# Altium schematic sheet MCU.SchDoc
size Legal; Author: FF7 HD Remastered; SheetNumber: 3; SheetTotal: 7
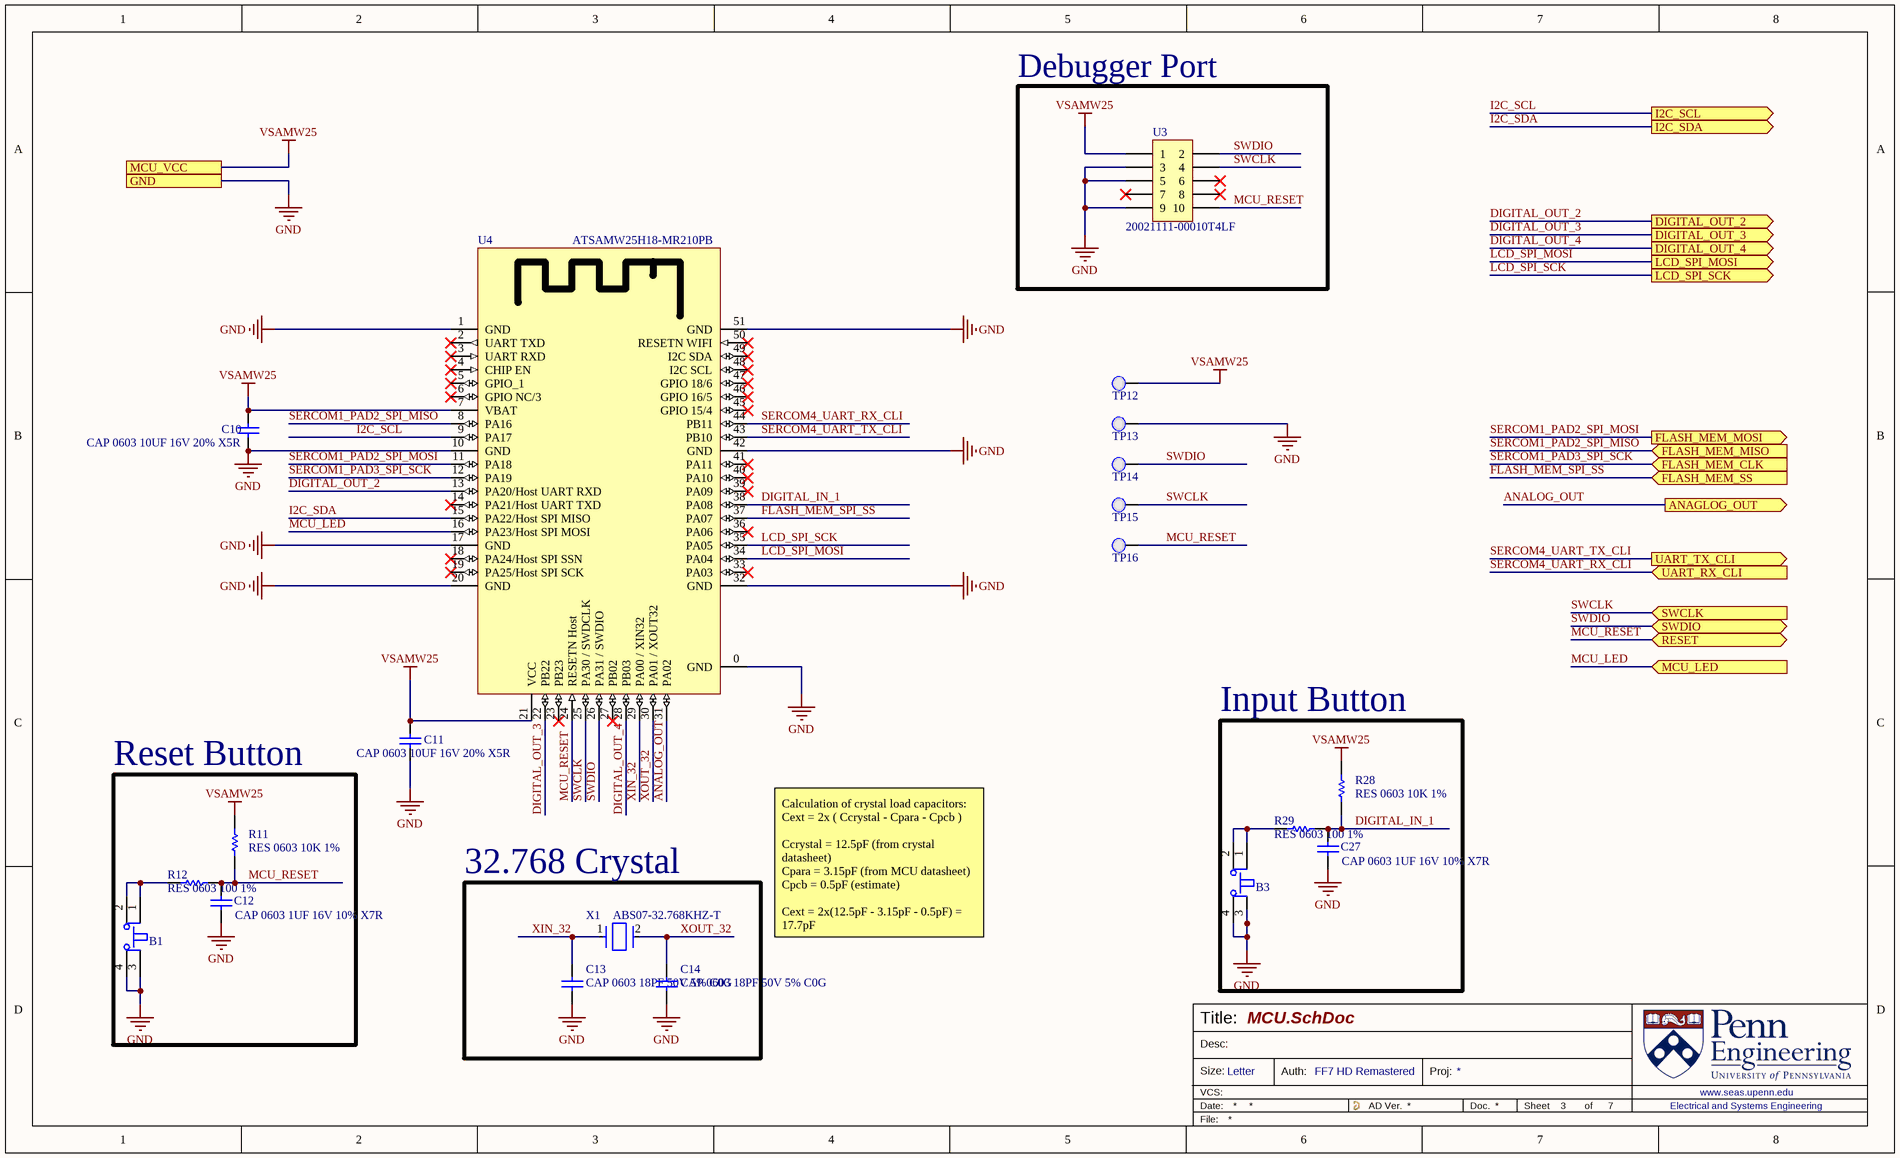
[diagram p0: MCU.SchDoc]

## Parts
B1  PTS810SJK250SMTRLFS  [PTS810SJK250SMTRLFS-Footprint-1]  (value not drawn)
B3  PTS810SJK250SMTRLFS  [PTS810SJK250SMTRLFS-Footprint-1]  (value not drawn)
C10  CAP 0603 10UF 16V 20% X5R  [0603_CAP]
C11  CAP 0603 10UF 16V 20% X5R  [0603_CAP]
C12  CAP 0603 1UF 16V 10% X7R  [0603_CAP]
C13  CAP 0603 18PF 50V 5% C0G  [0603_CAP]
C14  CAP 0603 18PF 50V 5% C0G  [0603_CAP]
C27  CAP 0603 1UF 16V 10% X7R  [0603_CAP]
R11  RES 0603 10K 1%  [0603_RES]
R12  RES 0603 100 1%  [0603_RES]
R28  RES 0603 10K 1%  [0603_RES]
R29  RES 0603 100 1%  [0603_RES]
TP12  Test Point 0.1"  [Test Point 0.1"-Footprint-1]  (value not drawn)  (no BOM)
TP13  Test Point 0.1"  [Test Point 0.1"-Footprint-1]  (value not drawn)  (no BOM)
TP14  Test Point 0.1"  [Test Point 0.1"-Footprint-1]  (value not drawn)  (no BOM)
TP15  Test Point 0.1"  [Test Point 0.1"-Footprint-1]  (value not drawn)  (no BOM)
TP16  Test Point 0.1"  [Test Point 0.1"-Footprint-1]  (value not drawn)  (no BOM)
U3  20021111-00010T4LF  [20021111-00010T4LF-Footprint-1]
U4  ATSAMW25H18-MR210PB  [SAMW25H18-MR510PB-Footprint-1]
X1  ABS07-32.768KHZ-T  [FP-ABS07-MFG]

## Blocks framed on the sheet
Debugger Port: U3
Input Button: B3 C27 R28 R29
Reset Button: B1 C12 R11 R12
32.768 Crystal: C13 C14 X1

## Ports
ANAGLOG_OUT (out), DIGITAL_OUT_2 (out), DIGITAL_OUT_3 (out), DIGITAL_OUT_4 (out), FLASH_MEM_CLK (in), FLASH_MEM_MISO (in), FLASH_MEM_MOSI (out), FLASH_MEM_SS (in), GND, I2C_SCL (out), I2C_SDA (out), LCD_SPI_MOSI (out), LCD_SPI_SCK (out), MCU_LED (in), MCU_VCC, RESET (bidir), SWCLK (in), SWDIO (bidir), UART_RX_CLI (in), UART_TX_CLI (out)

## Nets
GND: B1.3 B1.4 B3.3 B3.4 C10.1 C11.1 C12.1 C13.1 C14.1 C27.1 TP13.1(PAD) U3.3 U3.5 U3.9 U4.0(GND) U4.1(GND) U4.10(GND) U4.17(GND) U4.20(GND) U4.32(GND) U4.42(GND) U4.51(GND) ; port GND
VSAMW25: C10.2 C11.2 R11.2 R28.2 TP12.1(PAD) U3.1 U4.7(VBAT) U4.21(VCC) ; port MCU_VCC
ANALOG_OUT: U4.31(PA02) ; port ANAGLOG_OUT
DIGITAL_IN_1: C27.2 R28.1 R29.2 U4.38(PA08)
DIGITAL_OUT_2: U4.13(PA20/Host_UART_RXD) ; port DIGITAL_OUT_2
DIGITAL_OUT_3: U4.22(PB22) ; port DIGITAL_OUT_3
DIGITAL_OUT_4: U4.28(PB03) ; port DIGITAL_OUT_4
FLASH_MEM_SPI_SS: U4.37(PA07) ; port FLASH_MEM_SS
I2C_SCL: U4.9(PA17) ; port I2C_SCL
I2C_SDA: U4.15(PA22/Host_SPI_MISO) ; port I2C_SDA
LCD_SPI_MOSI: U4.34(PA04) ; port LCD_SPI_MOSI
LCD_SPI_SCK: U4.35(PA05) ; port LCD_SPI_SCK
MCU_LED: U4.16(PA23/Host_SPI_MOSI) ; port MCU_LED
MCU_RESET: C12.2 R11.1 R12.2 TP16.1(PAD) U3.10 U4.24(RESETN_Host) ; port RESET
SERCOM1_PAD2_SPI_MISO: U4.8(PA16) ; port FLASH_MEM_MISO
SERCOM1_PAD2_SPI_MOSI: U4.11(PA18) ; port FLASH_MEM_MOSI
SERCOM1_PAD3_SPI_SCK: U4.12(PA19) ; port FLASH_MEM_CLK
SERCOM4_UART_RX_CLI: U4.44(PB11) ; port UART_RX_CLI
SERCOM4_UART_TX_CLI: U4.43(PB10) ; port UART_TX_CLI
SWCLK: TP15.1(PAD) U3.4 U4.25(PA30_/_SWDCLK) ; port SWCLK
SWDIO: TP14.1(PAD) U3.2 U4.26(PA31_/_SWDIO) ; port SWDIO
XIN_32: C13.2 U4.29(PA00_/_XIN32) X1.1
XOUT_32: C14.2 U4.30(PA01_/_XOUT32) X1.2
NetB1_1: B1.1 B1.2 R12.1
NetB3_1: B3.1 B3.2 R29.1

Not connected (* = marked no-connect by the designer): U3 6* 7* 8*; U4 2(UART_TXD)* 3(UART_RXD)* 4(CHIP_EN)* 5(GPIO_1)* 6(GPIO_NC/3)* 14(PA21/Host_UART_TXD)* 18(PA24/Host_SPI_SSN)* 19(PA25/Host_SPI_SCK)* 23(PB23)* 27(PB02)* 33(PA03)* 36(PA06)* 39(PA09)* 40(PA10)* 41(PA11)* 45(GPIO_15/4)* 46(GPIO_16/5)* 47(GPIO_18/6)* 48(I2C_SCL)* 49(I2C_SDA)* 50(RESETN_WIFI)*

## Notes on the sheet
- Calculation of crystal load capacitors:
  Cext = 2x ( Ccrystal - Cpara - Cpcb )
  Ccrystal = 12.5pF (from crystal datasheet)
  Cpara = 3.15pF (from MCU datasheet)
  Cpcb = 0.5pF (estimate)
  Cext = 2x(12.5pF - 3.15pF - 0.5pF) = 17.7pF
- Title:
- Desc:
- Size:
- Letter
- Auth:
- Proj:
- Sheet
- of
- www.seas.upenn.edu
- Electrical and Systems Engineering

## Library data of the parts
B1 B3 = CMP-00084-2: Keypad Switch, 1 Switches, SPST, Momentary-tactile, 0.05A, 16VDC, 3.23N, Solder Terminal, Surface Mount-straight; Manufacturer Series: PTS810; Actuator Length: 0.028inch; Electrical Life: 50000Cycles; Contact Resistance: 0.5mR; Solderability: REFLOW; Actuator Travel: 0.1524mm; Actuator Color: White; Actuator Type: Pushbutton; Insulation Resistance: 100MR; Dielectric Withstand Volts: 250VACV; Switch Function: OFF-MOM; Reach SVHC Compliant: Yes; Terminal Finish: Silver; Switch Type: Keypad; Switch Action: MOMENTARY; RoHS Compliant: Yes; JESD-609 Code: e4; Max Operating Temperature: 85°C; Termination: Solder; Min Operating Temperature: -40°C; Mounting Technology: Surface Mount; Circuit: SPST; Type: Tactile
C10 C11 = CMP-011-000263-1: Capacitor Surface Mount 0603 Footprint 10UF 16V 20% Tolerance Ceramic X5R; Manufacturer: Various; Description in Visual: Cap SMT 0603 10UF 16V 20% Ceramic X5R; PCB Package: 0603; Type: Ceramic X5R; Mount: SMT; P/N: CAP 0603 10UF 16V 20% X5R; Manufacturer P/N: CAP 0603 10UF 16V 20% X5R
C12 C27 = CMP-011-000286-1: Capacitor Surface Mount 0603 Footprint 1UF 16V 10% Tolerance Ceramic X7R; Manufacturer: Various; PCB Package: 0603; Description in Visual: Cap SMT 0603 1UF 16V 10% Ceramic X7R; P/N: CAP 0603 1UF 16V 10% X7R; Manufacturer P/N: CAP 0603 1UF 16V 10% X7R; Tolerance: 10%; Type: Ceramic X7R; Value: 1UF; Mount: SMT; Voltage: 16V
C13 C14 = CMP-011-000283-1: Capacitor Surface Mount 0603 Footprint 18PF 50V 5% Tolerance Ceramic C0G; Manufacturer: Various; Description in Visual: Cap SMT 0603 18PF 50V 5%  Cer C0G; PCB Package: 0603; Voltage: 50V; Type: Ceramic C0G; Tolerance: 5%; Manufacturer P/N: CAP 0603 18PF 50V 5% C0G; Value: 18PF; P/N: CAP 0603 18PF 50V 5% C0G; Mount: SMT
R11 R28 = CMP-005-002156-2: Resistor Surface Mount, 10K Ohms, 0603 Footprint, 1% Tolerance 0.1W; Manufacturer: Various; PCB Package: 0603; Description in Visual: Res SMT 10K 0603  1%  0.1W; Manufacturer P/N: RES 0603 10K 1%; Tolerance: 1%; Mount: SMT; Value: 10k; JLCPCB Part #: C25804; Power Rating: 0.1W
R12 R29 = CMP-005-002125-1: Resistor Surface Mount, 100 Ohms, 0603 Footprint, 1% Tolerance 0.1W; Manufacturer: Various; Manufacturer P/N: RES 0603 100R 1%; Value: 100; Description in Visual: Res SMT 100 0603  1%  0.1W; PCB Package: 0603; Mount: SMT; Tolerance: 1%; Power Rating: 0.1W
TP12-TP16 = CMP-00086-1
U3 = CMP-00083-1: Board Connector, 10 Contact(s), 2 Row(s), Male, Straight, 0.05 inch Pitch, Solder Terminal, Locking, Black Insulator, Receptacle; Number Of PCB Rows: 2; PCB Contact Pattern: RECTANGULAR; Option: General Purpose; Body Depth: 0.098inch; Insulation Resistance: 100MR; Dielectric Withstanding Voltage (AC): 700V; Withdrawl Force-Min: 0.1946N; Body Length: 0.25inch; IEC Conformance: No; Body Breadth: 0.135inch; Rated Current (Signal): 1A; Plating Thickness: 10uin; Reliability: COMMERCIAL; Number Of Connectors: 1; PCB Contact Row Spacing: 1.27mm; Insertion Force-Max: 2.1406N; Contact Style: SQ PIN-SKT; Durability: 100Cycles; Contact Resistance: 30mR; Number of Contacts: 10; Reference Standard: UL; Insulation Material: Thermoplastic; Connector Type: BOARD CONNECTOR; Termination: Solder; Contact Finish - Mating: GOLD (10); Mounting Technology: Board; RoHS Compliant: Yes; Terminal Length: 0.091inch; Body/Shell Style: RECEPTACLE; Number of Rows Loaded: 2; Contact Gender: Male; Terminal Pitch: 1.27mm; Max Operating Temperature: 125°C; Mounting Option 1: LOCKING; JESD-609 Code: e3; DIN Conformance: No; Reach SVHC Compliant: Yes; Contact Finish - Termination: Matte Tin (Sn); Mounting Style: STRAIGHT; Min Operating Temperature: -40°C; MIL Conformance: No; Contact Material: Copper Alloy; Filter Feature: No; Mating Contact Pitch: 0.05inch; Insulation Color: Black; Flammability Rating: UL94 V-0; Mating Contact Row Spacing: 0.05inch; Mixed Contacts: No; Contact Pattern: RECTANGULAR
U4 = CMP-00082-2: 2.7 - 4.2 V 65 Mbps 17 dbm 256 kB Flash 32 kB SRAM 802.11 b/g/n Smart Module
X1 = CMP-0447-00001-4: Crystal 32.768kHz ±20ppm (Tol) 12.5pF FUND 70kΩ 2-Pin CSMD T/R; ESR (Equivalent Series Resistance): 70kR; Frequency: 32.768kHz; Radiation Hardening: No; Length: 3.2mm; Max Operating Temperature: 85°C; Number of Pins: 2; Series: ABS07; Min Operating Temperature: -40°C; Frequency Tolerance: 20ppm; Packaging: Tape and Reel; Height: 0.9mm; Width: 1.5mm; Depth: 1.5mm; Load Capacitance: 12.5pF; RoHS Compliant: Yes; Tolerance: 20ppm; Termination: SMD/SMT; Lead Free: Lead Free; Series Resistance: 70kR; REACH SVHC: No SVHC; Case/Package: CSMD; Operating Frequency: 32.768 kHz; Package Quantity: 3000